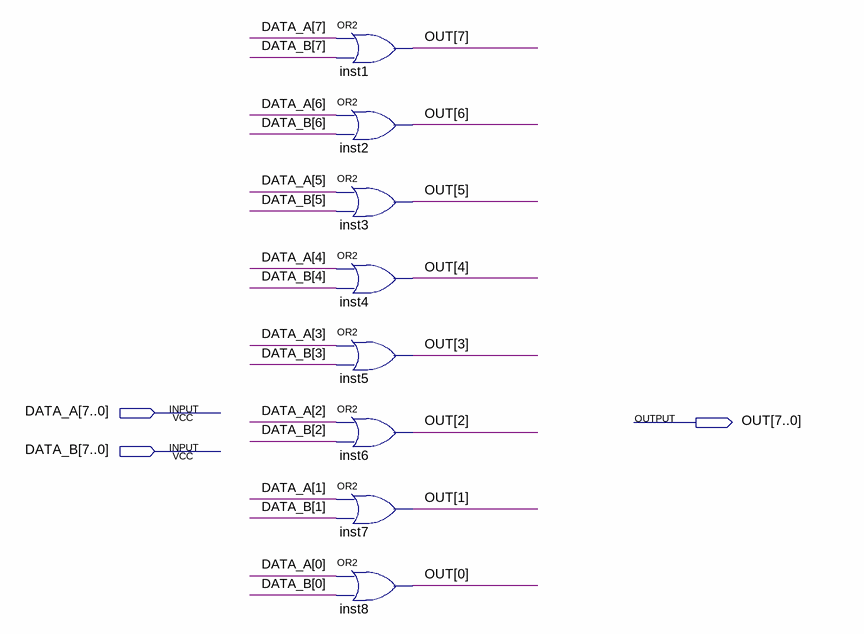
[diagram p0: schematic sheet]
// Quartus schematic OR8bit.bdf as structural Verilog: 8 symbols, 3 pins
module OR8bit (
  input  [7:0] DATA_A,
  input  [7:0] DATA_B,
  output [7:0] OUT
);

  or inst1 (OUT[7], DATA_A[7], DATA_B[7]);
  or inst2 (OUT[6], DATA_A[6], DATA_B[6]);
  or inst3 (OUT[5], DATA_A[5], DATA_B[5]);
  or inst4 (OUT[4], DATA_A[4], DATA_B[4]);
  or inst5 (OUT[3], DATA_A[3], DATA_B[3]);
  or inst6 (OUT[2], DATA_A[2], DATA_B[2]);
  or inst7 (OUT[1], DATA_A[1], DATA_B[1]);
  or inst8 (OUT[0], DATA_A[0], DATA_B[0]);
endmodule
